# EAGLE design av_amp_04 (EAGLE 9.5.1)
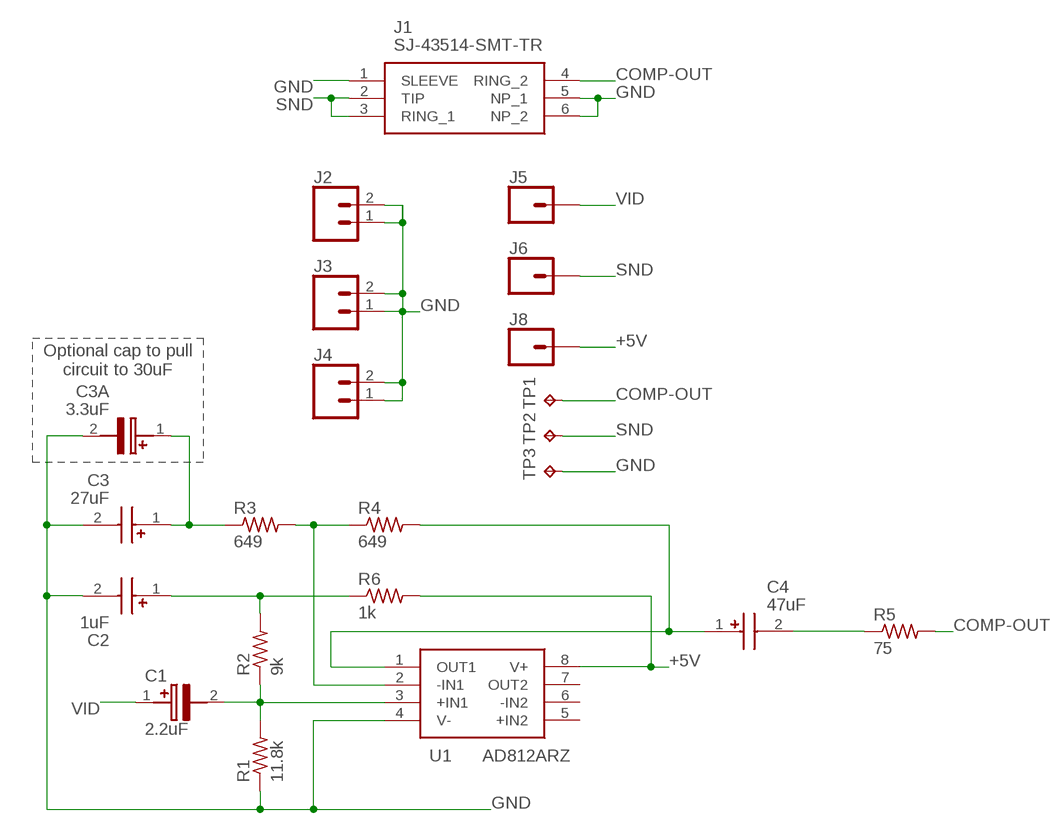
[diagram p0: schematic, sheet 1]

## Parts
C1  2.2uF  EEE-FC1H2R2R  [CAPAE430X550N]
C2  1uF  EDH105M050S9BAA  [CAPAE430X565N]
C3  27uF  865080342004  [865080342004]
C3A  3.3uF  865080540001  [865080540001]
C4  47uF  EDK476M016A9DAA  [EDK(5X5.4)]
J1  SJ-43514-SMT-TR  [SJ-43514-SMT-TR]
J2  CONN_02  [1X02]
J3  CONN_02  [1X02]
J4  CONN_02  [1X02]
J5  CONN_01  [1X01]
J6  CONN_01  [1X01]
J8  CONN_01  [1X01]
R1  11.8k  R-US_R0603  [R0603]
R2  9k  R-US_R0603  [R0603]
R3  649  R-US_R0603  [R0603]
R4  649  R-US_R0603  [R0603]
R5  75  R-US_R0603  [R0603]
R6  1k  R-US_R0603  [R0603]
TP1  TPB2,54  [B2,54]
TP2  TPB2,54  [B2,54]
TP3  TPB2,54  [B2,54]
U1  AD812ARZ  [SOIC127P600X175-8N]

## Nets
+5V [power]: J8.1 R6.2 U1.8(V+)
COMP-OUT: J1.4(RING_2) R5.2 TP1.TP
GND [power]: C2.2(-) C3.2(+) C3A.2(-) J1.1(SLEEVE) J1.5(NP_1) J1.6(NP_2) J2.1 J2.2 J3.1 J3.2 J4.1 J4.2 R1.1 TP3.TP U1.4(V-)
N$1: C3.1(-) C3A.1(+) R3.1
N$2: R3.2 R4.1 U1.2(-IN1)
N$3: C1.2(-) R1.2 R2.1 U1.3(+IN1)
N$4: C4.1(+) R4.2 U1.1(OUT1)
N$5: C4.2(-) R5.1
N$6: C2.1(+) R2.2 R6.1
SND: J1.2(TIP) J1.3(RING_1) J6.1 TP2.TP
VID: C1.1(+) J5.1
Unconnected: U1.5(+IN2) U1.6(-IN2) U1.7(OUT2)

## Notes on the sheet
- Optional cap to pull
  circuit to 30uF

## Library data of the parts
C1 = SamacSys_Parts:EEE-FC1H2R2R: PANASONIC - EEE-FC1H2R2R - ALUMINUM ELECTROLYTIC CAPACITOR, 2.2UF, 50V, 20%, SMD, FULL REEL Source: Datasheet <https://componentsearchengine.com/Datasheets/1/EEE-FC1H2R2R.pdf>; DESCRIPTION: PANASONIC - EEE-FC1H2R2R - ALUMINUM ELECTROLYTIC CAPACITOR, 2.2UF, 50V, 20%, SMD, FULL REEL; HEIGHT: 5.5mm; MANUFACTURER_NAME: Panasonic; MANUFACTURER_PART_NUMBER: EEE-FC1H2R2R; MOUSER_PART_NUMBER: 667-EEE-FC1H2R2R; MOUSER_PRICE-STOCK: https://www.mouser.com/Search/Refine.aspx?Keyword=667-EEE-FC1H2R2R
C2 = EDH105M050S9BAA:EDH105M050S9BAA: Aluminum Electrolytic Capacitors - SMD 50V 1uF 20% AEC-Q200 Source: Datasheet <https://componentsearchengine.com/Datasheets/1/EDH105M050S9BAA.pdf>; DESCRIPTION: Aluminum Electrolytic Capacitors - SMD 50V 1uF 20% AEC-Q200; HEIGHT: 5.65mm; MANUFACTURER_NAME: Kemet; MANUFACTURER_PART_NUMBER: EDH105M050S9BAA; MOUSER_PART_NUMBER: 80-EDH105M050S9BAA; MOUSER_PRICE-STOCK: https://www.mouser.com/Search/Refine.aspx?Keyword=80-EDH105M050S9BAA
C3 = SamacSys_Parts:865080342004: Wurth Elektronik 6.8uF 50 V dc Aluminium Electrolytic Capacitor, WCAP-ASLI Series 2000h 5 (Dia.) x 5.35mm Source: Datasheet <https://componentsearchengine.com/Datasheets/1/865080342004.pdf>; DESCRIPTION: Wurth Elektronik 6.8uF 50 V dc Aluminium Electrolytic Capacitor, WCAP-ASLI Series 2000h 5 (Dia.) x 5.35mm; HEIGHT: 5.5mm; MANUFACTURER_NAME: Wurth Elektronik; MANUFACTURER_PART_NUMBER: 865080342004; MOUSER_PART_NUMBER: 710-865080342004; MOUSER_PRICE-STOCK: https://www.mouser.com/Search/Refine.aspx?Keyword=710-865080342004
C3A = SamacSys_Parts:865080540001: Wurth Elektronik 3.3uF 35 V dc Aluminium Electrolytic Capacitor, WCAP-ASLI Series 2000h 4 (Dia.) x 5.35mm Source: Datasheet <https://componentsearchengine.com/Datasheets/1/865080540001.pdf>; DESCRIPTION: Wurth Elektronik 3.3uF 35 V dc Aluminium Electrolytic Capacitor, WCAP-ASLI Series 2000h 4 (Dia.) x 5.35mm; HEIGHT: 5.5mm; MANUFACTURER_NAME: Wurth Elektronik; MANUFACTURER_PART_NUMBER: 865080540001; MOUSER_PART_NUMBER: 710-865080540001; MOUSER_PRICE-STOCK: https://www.mouser.com/Search/Refine.aspx?Keyword=710-865080540001
C4 = SamacSys_Parts:EDK476M016A9DAA: KEMET - EDK476M016A9DAA - CAP, ALU ELEC, 47UF, 16V, SMD, REEL Source: Datasheet <https://componentsearchengine.com/Datasheets/1/EDK476M016A9DAA.pdf>; DESCRIPTION: KEMET - EDK476M016A9DAA - CAP, ALU ELEC, 47UF, 16V, SMD, REEL; HEIGHT: mm; MANUFACTURER_NAME: Kemet; MANUFACTURER_PART_NUMBER: EDK476M016A9DAA; MOUSER_PART_NUMBER: 80-EDK476M016A9DAA; MOUSER_PRICE-STOCK: https://www.mouser.com/Search/Refine.aspx?Keyword=80-EDK476M016A9DAA
J1 = SamacSys_Parts:SJ-43514-SMT-TR: Phone Connectors Audio Jacks Source: Datasheet <https://componentsearchengine.com/Datasheets/1/SJ-43514-SMT-TR.pdf>; DESCRIPTION: Phone Connectors Audio Jacks; HEIGHT: mm; MANUFACTURER_NAME: CUI; MANUFACTURER_PART_NUMBER: SJ-43514-SMT-TR; MOUSER_PART_NUMBER: 490-SJ-43514-SMT-TR; MOUSER_PRICE-STOCK: https://www.mouser.com/Search/Refine.aspx?Keyword=490-SJ-43514-SMT-TR
J2-J4 = SparkFun-Connectors:CONN_02: Multi connection point. Often used as Generic Header-pin footprint for 0.1 inch spaced/style header connections On any of the 0.1 inch spaced packages, you can populate with these: Break Away Headers - Straight <https://www.sparkfun.com/products/116> (PRT-00116) Break Away Male Headers - Right Angle <https://www.sparkfun.com/products/553> (PRT-00553) Female Headers <https://www.sparkfun.com/products/115> (PRT-00115) Break Away Headers - Machine Pin <https://www.sparkfun.com/products/117> (PRT-00117) Break Away Female Headers - Swiss Machine Pin <https://www.sparkfun.com/products/743> (PRT-00743) For SCREWTERMINALS and SPRING TERMINALS visit here: Screw Terimnals on SparkFun.com <https://www.sparkfun.com/search/results?term=Screw+Terminals> (5mm/3.5mm/2.54mm spacing) This device is also useful as a general connection point to wire up your design to another part of your project. Our various solder wires solder well into these plated through hole pads. Hook-Up Wire - Assortment (Stranded, 22 AWG) <https://www.sparkfun.com/products/11375> (PRT-11375) Hook-Up Wire - Assortment (Solid Core, 22 AWG) <https://www.sparkfun.com/products/11367> (PRT-11367) View the entire wire category on our website here <https://www.sparkfun.com/categories/141> Special notes: Molex polarized connector foot print use with: PRT-08233 with associated crimp pins and housings. 2.54_SCREWTERM for use with PRT-10571. 3.5mm Screw Terminal footprints for PRT-08084 5mm Screw Terminal footprints for use with PRT-08432
J5 J6 J8 = SparkFun-Connectors:CONN_01: Single connection point. Often used as Generic Header-pin footprint for 0.1 inch spaced/style header connections On any of the 0.1 inch spaced packages, you can populate with these: Break Away Headers - Straight <https://www.sparkfun.com/products/116> (PRT-00116) Break Away Male Headers - Right Angle <https://www.sparkfun.com/products/553> (PRT-00553) Female Headers <https://www.sparkfun.com/products/115> (PRT-00115) Break Away Headers - Machine Pin <https://www.sparkfun.com/products/117> (PRT-00117) Break Away Female Headers - Swiss Machine Pin <https://www.sparkfun.com/products/743> (PRT-00743) This device is also useful as a general connection point to wire up your design to another part of your project. Our various solder wires solder well into these plated through hole pads. Hook-Up Wire - Assortment (Stranded, 22 AWG) <https://www.sparkfun.com/products/11375> (PRT-11375) Hook-Up Wire - Assortment (Solid Core, 22 AWG) <https://www.sparkfun.com/products/11367> (PRT-11367) View the entire wire category on our website here <https://www.sparkfun.com/categories/141> Special notes: SMTSO-256-ET is a "flush mount" nut for a 4-40 screw. We mostly use this on specialty testbeds; it is a nice way to connect hardware to your PCB at an adjustable hieght. Also note, the SNAP packages are for using a snappable style connector. We sell a baggie of snaps and they are also used on two LilyPad designs: Snap Assortment - 30 pack (male and female) <https://www.sparkfun.com/products/11347> (DEV-11347) LilyPad Arduino SimpleSnap <https://www.sparkfun.com/products/10941> (DEV-10941) LilyPad SimpleSnap Protoboard <https://www.sparkfun.com/products/10940> (DEV-10940)
R1-R6 = rcl:R-US_: RESISTOR, American symbol; SPICEPREFIX: R
TP1-TP3 = testpad:TP: Test pad
U1 = AD812ARZ:AD812ARZ: AD812ARZ, Video Amplifier 2-channel 125V/s, 8-Pin SOIC N Source: Datasheet <https://componentsearchengine.com/Datasheets/1/AD812ARZ.pdf>; DESCRIPTION: AD812ARZ, Video Amplifier 2-channel 125V/s, 8-Pin SOIC N; HEIGHT: 1.75mm; MANUFACTURER_NAME: Analog Devices; MANUFACTURER_PART_NUMBER: AD812ARZ; MOUSER_PART_NUMBER: 584-AD812ARZ; MOUSER_PRICE-STOCK: https://www.mouser.com/Search/Refine.aspx?Keyword=584-AD812ARZ

## Net classes
1 power: width 0.381 mm, drill 0.254 mm, clearance 0.254 mm

## Board
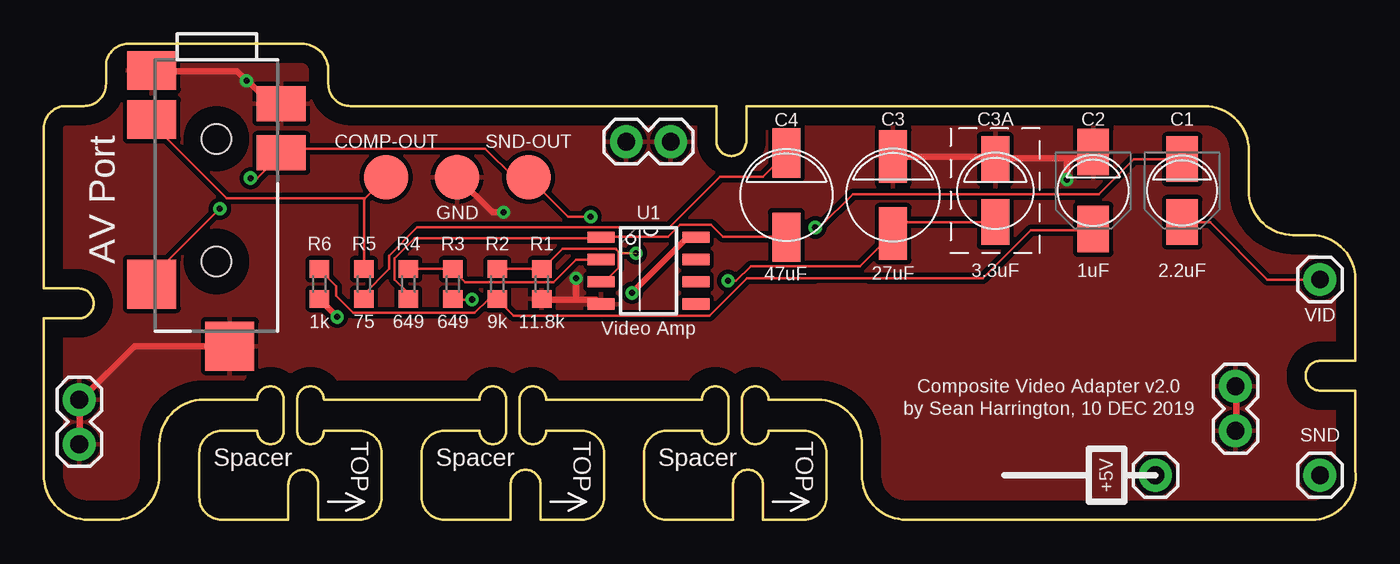
[diagram p1: board, top side]
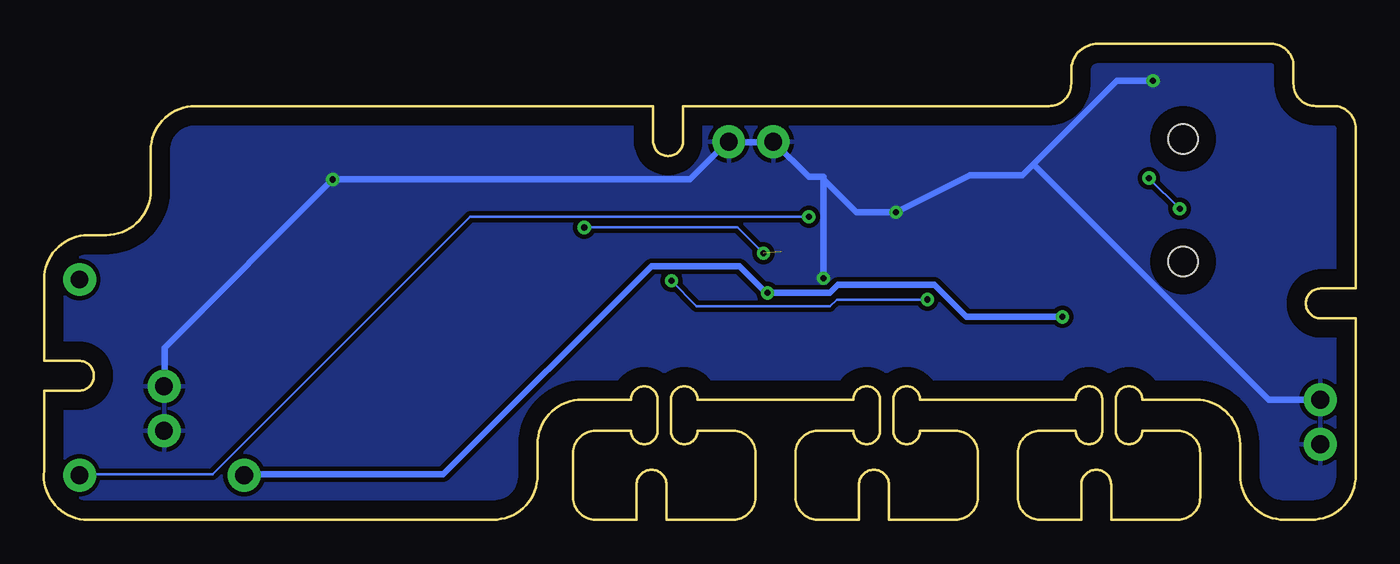
[diagram p2: board, bottom side, seen from below]

Size 74.94 x 27.18 mm. Coordinates in mm from the lower left corner, seen from the top.
Outline: 4.83,27.18 14.73,27.18 arc-90 16.26,25.65 16.26,24.89 arc90 17.53,23.62 38.42,23.62 38.42,21.62 arc180 40.13,21.62 40.13,23.62 66.29,23.62 arc-90 68.83,21.08 68.83,18.8 arc90 71.37,16.26 72.39,16.26 arc-90 74.93,13.72 74.93,9.07 72.93,9.07 arc180 72.93,7.37 74.93,7.37 74.93,2.79 arc-90 72.64,0 49.28,0 arc-90 46.74,2.54 46.74,4.32 arc90 44.2,6.86 41.4,6.86 arc180 39.88,6.86 39.88,5.08 arc180 41.4,5.08 43.43,5.08 arc-90 44.7,3.81 44.7,1.27 arc-90 43.43,0 41.08,0 41.08,2 arc180 39.37,2 39.37,0 35.56,0 arc-90 34.29,1.27 34.29,1.52 34.29,3.81 arc-90 35.56,5.08 37.59,5.08 arc180 39.12,5.08 39.12,6.86 arc180 37.59,6.86 28.7,6.86 arc180 27.18,6.86 27.18,5.08 arc180 28.7,5.08 30.73,5.08 arc-90 32,3.81 32,1.27 arc-90 30.73,0 28.38,0 28.38,2 arc180 26.67,2 26.67,0 22.86,0 arc-90 21.59,1.27 21.59,1.52 21.59,3.81 arc-90 22.86,5.08 24.89,5.08 arc180 26.42,5.08 26.42,6.86 arc180 24.89,6.86 16,6.86 arc180 14.48,6.86 14.48,5.08 arc180 16,5.08 18.03,5.08 arc-90 19.3,3.81 19.3,1.27 arc-90 18.03,0 15.68,0 15.68,2 arc180 13.97,2 13.97,0 10.16,0 arc-90 8.89,1.27 8.89,1.52 8.89,3.81 arc-90 10.16,5.08 12.19,5.08 arc180 13.72,5.08 13.72,6.86 arc180 12.19,6.86 9.14,6.86 arc90 6.6,4.32 6.6,2.54 arc-90 4.06,0 2.54,0 arc-90 0,2.54 0,11.5 2,11.5 arc180 2,13.21 0,13.21 0,22.35 arc-90 1.27,23.62 2.29,23.62 arc90 3.56,24.89 3.56,25.91 arc-90 4.83,27.18
Copper layers (1*16): Top 0.035mm / dielectric 1.5mm / Bottom 0.035mm
Design rules "default": minimum track width 6mil, minimum drill 0.35mm, track to track 6mil, track to pad 6mil, pad to pad 6mil, via to via 6mil, smd to smd 6mil, copper to edge 40mil, drill to drill 6mil, minimum pad ring 10mil, minimum via ring 8mil, stop-mask expansion 4mil, vias tented up to drill 0mil, thermal gap 10mil

### Footprints (pad centres in the part's own frame; a part is rotated, then mirrored left to right if it is on the bottom)
CAPAE430X550N = smd 2.6 x 1.8: 1 -1.8,0; 2 1.8,0
CAPAE430X565N = smd 2.65 x 1.8: 1 -2.2,0; 2 2.2,0
865080342004 = smd 3 x 1.6: 1 -2.2,0; 2 2.2,0
865080540001 = smd 2.6 x 1.6: 1 -1.8,0; 2 1.8,0
EDK(5X5.4) = smd 2.8 x 1.6: 1 -2.4,0; 2 2.4,0
SJ-43514-SMT-TR = smd 2.2 x 2.8: 1 0,0; 4 2.8,0 | smd 2.8 x 2.8: 2 12.2,0; 5 15.735,4.45 | smd 2 x 2.8: 3 4.7,7.4; 6 1.9,7.4 | hole 1.7: 10.9,3.7; 3.9,3.7
1X02 = drill 1.016 pad 1.88: 1 0,0; 2 2.54,0
1X01 = drill 1.016 pad 1.88: 1 0,0
R0603 = smd 1 x 1.1: 1 -0.85,0; 2 0.85,0
B2,54 = smd 2.54 x 2.54: TP 0,0
SOIC127P600X175-8N = smd 1.525 x 0.65: 1 -2.712,1.905; 2 -2.712,0.635; 3 -2.712,-0.635; 4 -2.712,-1.905; 5 2.712,-1.905; 6 2.712,-0.635; 7 2.712,0.635; 8 2.712,1.905

### Placement (x,y rotation side)
C1  65.02,18.8 90 top
C2  59.94,18.8 90 top
C3  48.51,18.54 90 top
C3A  54.36,18.8 90 top
C4  42.42,18.54 90 top
J1  6.17,25.65 270 top
J2  33.27,21.59 0 top
J3  2.03,4.32 90 top
J4  68.07,5.08 90 top
J5  72.9,13.72 0 top
J6  72.9,2.54 0 top
J8  63.5,2.54 270 top
R1  28.45,13.46 90 top
R2  25.91,13.46 270 top
R3  23.37,13.46 90 top
R4  20.83,13.46 270 top
R5  18.29,13.46 90 top
R6  15.75,13.46 270 top
TP1  19.56,19.56 0 top
TP2  27.69,19.56 0 top
TP3  23.62,19.56 0 top
U1  34.54,14.22 0 top

### Tracks (layer width: path | path; a pad name or v marks a point on that pad's centre or on a via)
+5V  (via drill 0.35)
  Top 0.381: v16.76,11.58 15.77,12.57 R6.2 | v33.6,12.95 36.73,16.08 37.19,16.08 U1.8
  Bottom 0.381: v16.76,11.58 22.25,11.58 24.08,13.41 29.57,13.41 30.02,12.95 v33.6,12.95 33.76,13.03 35.2,14.48 40.23,14.48 52.12,2.59 63.48,2.59 J8.1
COMP-OUT
  Top 0.152: 18.33,18.33 19.51,19.51 TP1.TP | 18.33,18.33 18.29,18.29 18.29,14.33 R5.2 | J1.4 6.17,22.78 6.17,22.63 10.44,18.36 18.29,18.36 18.33,18.33
GND  (via drill 0.35)
  Top 0.381: J4.1 68.12,5.11 68.12,7.62 J4.2 | 58.45,20.65 59.59,20.65 59.89,20.95 C2.2 | 58.45,20.65 54.41,20.65 C3A.2 54.25,20.73 48.54,20.73 C3.2 | v58.45,19.43 58.45,20.5 58.45,20.65 | J3.1 2.06,4.34 2.06,6.86 J3.2 2.21,6.93 5.18,9.91 10.59,9.91 J1.5 | 30.4,12.57 31.55,12.57 31.77,12.34 U1.4 | 30.4,12.57 28.5,12.57 R1.1 | TP3.TP 25.63,17.55 v26.26,17.55 | v30.4,13.79 30.4,12.72 30.4,12.57 | J1.1 6.17,25.6 11.05,25.6 v11.58,25.07 11.73,24.99 12.95,23.77 13.56,23.77 J1.6
  Bottom 0.381: J4.2 68.05,7.62 68.05,9.83 v58.45,19.43 58.29,19.43 38.02,19.43 35.97,21.49 J2.2 35.81,21.57 33.45,21.57 J2.1 33.22,21.57 31.24,19.58 30.4,19.58 30.4,19.43 | 30.4,19.43 28.52,17.55 v26.26,17.55 22.05,19.66 19.05,19.66 18.4,20.31 | 30.4,19.43 v30.4,13.79 | v11.58,25.07 13.64,25.07 18.4,20.31 | J3.2 2.06,6.86 4.95,6.86 18.29,20.19 18.4,20.31
  pour Top: 0,23.62 3.56,23.62 3.56,27.18 16.26,27.18 16.26,23.62 68.83,23.62 68.83,16.26 74.93,16.26 74.93,0 46.74,0 46.74,6.86 6.86,6.86 6.6,6.6 6.6,0 0,0
  pour Bottom: 0,23.62 3.56,23.62 3.56,27.18 16.26,27.18 16.26,23.62 68.83,23.62 68.83,16.26 74.93,16.26 74.93,0 46.74,0 46.74,6.86 6.6,6.86 6.6,0 0,0
LOGO
  pour Top: 41.66,12.95 39.12,8.38 43.43,8.38 44.2,7.37 49.28,7.37 49.28,8.38 61.72,8.38 62.48,7.87 64.26,7.87 65.79,9.65 65.79,12.95 48.01,12.95 46.99,13.46 44.2,13.46 43.18,12.95
N$1  (via drill 0.35)
  Top 0.152: v24.46,12.57 23.39,12.57 R3.1 | v39.09,13.64 39.55,13.64 40.39,14.48 46.63,14.48 48.46,16.31 C3.1 48.54,16.38 49.15,16.99 54.33,16.99 C3A.1
  Bottom 0.152: v24.46,12.57 29.64,12.57 30.02,12.19 37.64,12.19 v39.09,13.64
N$2
  Top 0.152: R4.1 20.88,14.33 23.32,14.33 R3.2 23.39,14.25 24.08,13.56 29.11,13.56 30.4,14.86 31.77,14.86 U1.2
N$3  (via drill 0.35)  (1 unrouted)
  Top 0.152: R2.1 25.91,14.33 28.42,14.33 R1.2 28.5,14.33 29.64,15.47 32.69,15.47 32.73,15.43 32.84,15.32 | U1.3 31.85,13.64 32.08,13.64 32.84,14.4 32.84,15.21 v33.83,15.21 | v44.07,16.69 44.32,16.69 46.23,18.59 60.27,18.59 62.26,20.57 65,20.57 C1.2
  Bottom 0.152: v44.07,16.69 35.31,16.69 34.09,15.47 v33.83,15.21
N$4
  Top 0.152: R4.2 20.8,12.65 20.8,12.95 20.04,13.72 20.04,14.94 21.18,16.08 31.77,16.08 U1.1 31.85,16.15 35.66,16.15 36.35,16.84 38.1,16.84 38.79,16.15 42.37,16.15 C4.1
N$5
  Top 0.152: R5.1 18.29,12.65 18.29,12.88 19.74,14.33 19.74,15.09 21.34,16.69 35.74,16.69 38.63,19.58 41.07,19.58 42.37,20.88 C4.2
N$6
  Top 0.152: 25.91,12.57 25.38,12.57 24.61,11.81 17.68,11.81 16.69,12.8 16.69,13.34 15.77,14.25 R6.1 | 25.91,12.57 R2.2 25.91,12.57 | 25.91,12.57 26.82,11.66 38.02,11.66 40.16,13.79 53.65,13.79 56.39,16.54 59.89,16.54 C2.1
SND  (via drill 0.35)
  Top 0.152: v10.06,17.75 6.17,13.87 6.17,13.49 J1.2 | v11.81,19.51 12.19,19.51 13.56,20.88 J1.3 13.64,20.95 13.87,21.18 25.22,21.18 26.82,19.58 27.66,19.58 TP2.TP 27.74,19.51 29.95,17.3 v31.24,17.3
  Bottom 0.152: v11.81,19.51 v10.06,17.75 | v31.24,17.3 50.6,17.3 65.3,2.59 72.85,2.59 J6.1
VID
  Top 0.152: C1.1 65.08,16.99 66.62,16.99 69.9,13.72 72.85,13.72 J5.1

### Text on the board
tPlace: COMP-OUT | SND-OUT | AV Port | GND | VID | Video Amp | Composite Video Adapter v2.0 | by Sean Harrington, 10 DEC 2019 | SND | Spacer | Spacer | Spacer | TOP | TOP | TOP | +5V